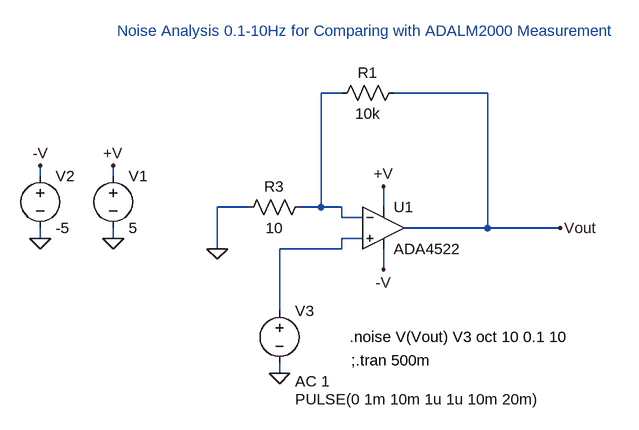
[diagram p0: schematic ADA4522Noise.asc]
ADA4522Noise.asc, the LTspice schematic file:
Version 4
SHEET 1 896 680
WIRE 160 -16 128 -16
WIRE 384 -16 240 -16
WIRE -304 112 -304 96
WIRE -192 112 -192 96
WIRE 16 160 -32 160
WIRE 128 160 128 -16
WIRE 128 160 96 160
WIRE 160 160 128 160
WIRE 224 160 224 128
WIRE 160 176 160 160
WIRE 192 176 160 176
WIRE 384 192 384 -16
WIRE 384 192 256 192
WIRE 496 192 384 192
WIRE -304 208 -304 192
WIRE -192 208 -192 192
WIRE 192 208 160 208
WIRE -32 224 -32 160
WIRE 160 224 160 208
WIRE 160 224 64 224
WIRE 224 256 224 224
WIRE 64 320 64 224
WIRE 64 416 64 400
FLAG -192 208 0
FLAG 224 128 +V
FLAG -192 96 +V
FLAG 64 416 0
FLAG -304 208 0
FLAG -304 96 -V
FLAG 224 256 -V
FLAG -32 224 0
FLAG 496 192 Vout
SYMBOL voltage -192 96 R0
SYMATTR InstName V1
SYMATTR Value 5
SYMBOL res 112 144 R90
WINDOW 0 0 56 VBottom 2
WINDOW 3 32 56 VTop 2
SYMATTR InstName R3
SYMATTR Value 10
SYMBOL voltage -304 96 R0
WINDOW 123 0 0 Left 0
WINDOW 39 0 0 Left 0
SYMATTR InstName V2
SYMATTR Value -5
SYMBOL voltage 64 304 R0
WINDOW 3 24 152 Left 2
WINDOW 123 24 124 Left 2
WINDOW 39 0 0 Left 0
SYMATTR InstName V3
SYMATTR Value PULSE(0 1m 10m 1u 1u 10m 20m)
SYMATTR Value2 AC 1
SYMBOL res 256 -32 R90
WINDOW 0 0 56 VBottom 2
WINDOW 3 32 56 VTop 2
SYMATTR InstName R1
SYMATTR Value 10k
SYMBOL OpAmps\\ADA4522 224 128 R0
SYMATTR InstName U1
TEXT 200 -96 Bottom 2 ;Noise Analysis 0.1-10Hz for Comparing with ADALM2000 Measurement
TEXT 174 396 Left 2 !;.tran 500m
TEXT 172 360 Left 2 !.noise V(Vout) V3 oct 10 0.1 10

The netlist it stands for:
* ADA4522Noise.asc
V1 +V 0 5
R3 N001 0 10
V2 -V 0 -5
V3 N002 0 PULSE(0 1m 10m 1u 1u 10m 20m) AC 1
R1 Vout N001 10k
XU1 N002 N001 +V -V Vout ADA4522  ; pins In+ In- V+ V- OUT
* Noise Analysis 0.1-10Hz for Comparing with ADALM2000 Measurement
;.tran 500m
.noise V(Vout) V3 oct 10 0.1 10
.backanno
.end